# Altium schematic sheet Sheet1.SchDoc: =Name-1str
size 420 x 297 mm; SheetNumber: номер страницы; Вид изделия: Документация; Раздел: Документация; Код документа: Э3; Вид документа: Схема электрическая принципиальная; Класс документа: Конструкторский документ; Создавать изделие в PLM: Yes; DocumentCode: Э3; DocumentView: Схема электрическая принципиальная; DocumentClass: Конструкторский документ; ProductView: Документация
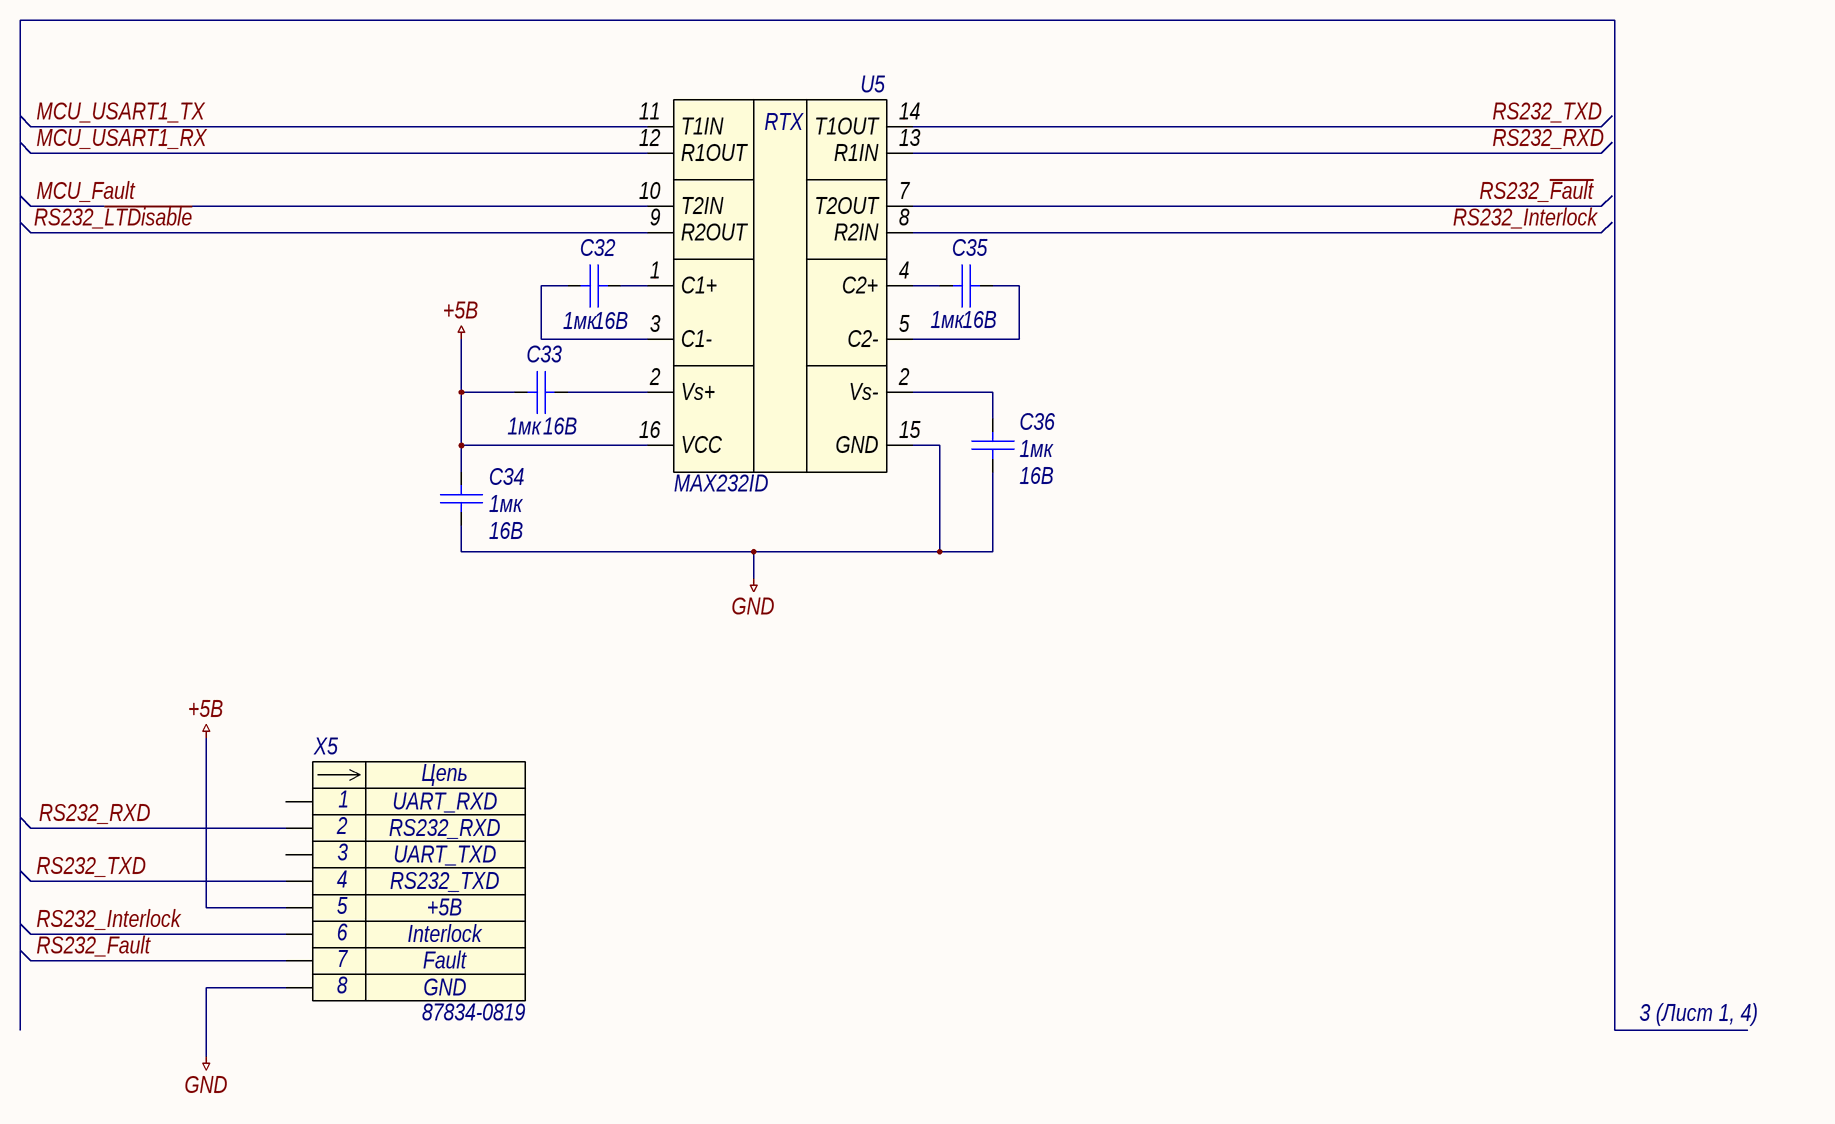
[diagram p0: Sheet1.SchDoc]

## Parts
C32  Voltage: 16В  [C0805_AA]  (hidden comment: 1мк)
C33  Voltage: 16В  [C0805_AA]  (hidden comment: 1мк)
C34  Voltage: 16В  [C0805_AA]  (hidden comment: 1мк)
C35  Voltage: 16В  [C0805_AA]  (hidden comment: 1мк)
C36  Voltage: 16В  [C0805_AA]  (hidden comment: 1мк)
U5  MAX232ID
X5  87834-0819

## Nets
+5В: C33.2 C34.1 U5.16(VCC) X5.5
GND: C34.2 C36.2 U5.15(GND) X5.8
MCU_Fault: U5.10(T2IN)
MCU_USART1_RX: U5.12(R1OUT)
MCU_USART1_TX: U5.11(T1IN)
RS232_~{Fault}: U5.7(T2OUT)
RS232_Fault: X5.7
RS232_Interlock: U5.8(R2IN) X5.6
RS232_~{LTDisable}: U5.9(R2OUT)
RS232_RXD: U5.13(R1IN) X5.2
RS232_TXD: U5.14(T1OUT) X5.4
NetC32_1: C32.1 U5.1(C1+)
NetC32_2: C32.2 U5.3(C1-)
NetC33_1: C33.1 U5.2(Vs+)
NetC35_1: C35.1 U5.5(C2-)
NetC35_2: C35.2 U5.4(C2+)
NetC36_1: C36.1 U5.2(Vs-)

Not connected (* = marked no-connect by the designer): X5 1 3

## Notes on the sheet
- 3 (Лист 1, 4)
- Подп. и дата
- Инв. № дубл.
- Взам. инв. №
- Инв. № подл.
- Лист
- Изм.
- № докум.
- Подп.
- Дата
- Копировал
- Формат
- А3
- (in symbol MAX232ID) RTX
- (in symbol x8-m) Цепь

## Library data of the parts
C32-C36 = Конденсатор кер.: Name: CC0603KRX7R7BB105; Value: 1мк
U5 = MAX232ID: Dual EIA-232 Drivers/Receivers
X5 = x8-m: Разъем - 8 конт. вилка; Contact_1: UART_RXD; Contact_2: RS232_RXD; Contact_3: UART_TXD; Contact_4: RS232_TXD; Contact_5: +5В; Contact_6: Interlock; Contact_7: Fault; Contact_8: GND; Name: 87834-0819